# EasyEDA schematic SCH_ProMicro_evo2_v2_2025-11-15.json
TITLE: ProMicro, Temp.sensor; REV: 1.0; Date: 2025-10-28; Sheet: 1/1; Drawn By: corlov; Company: Your Company
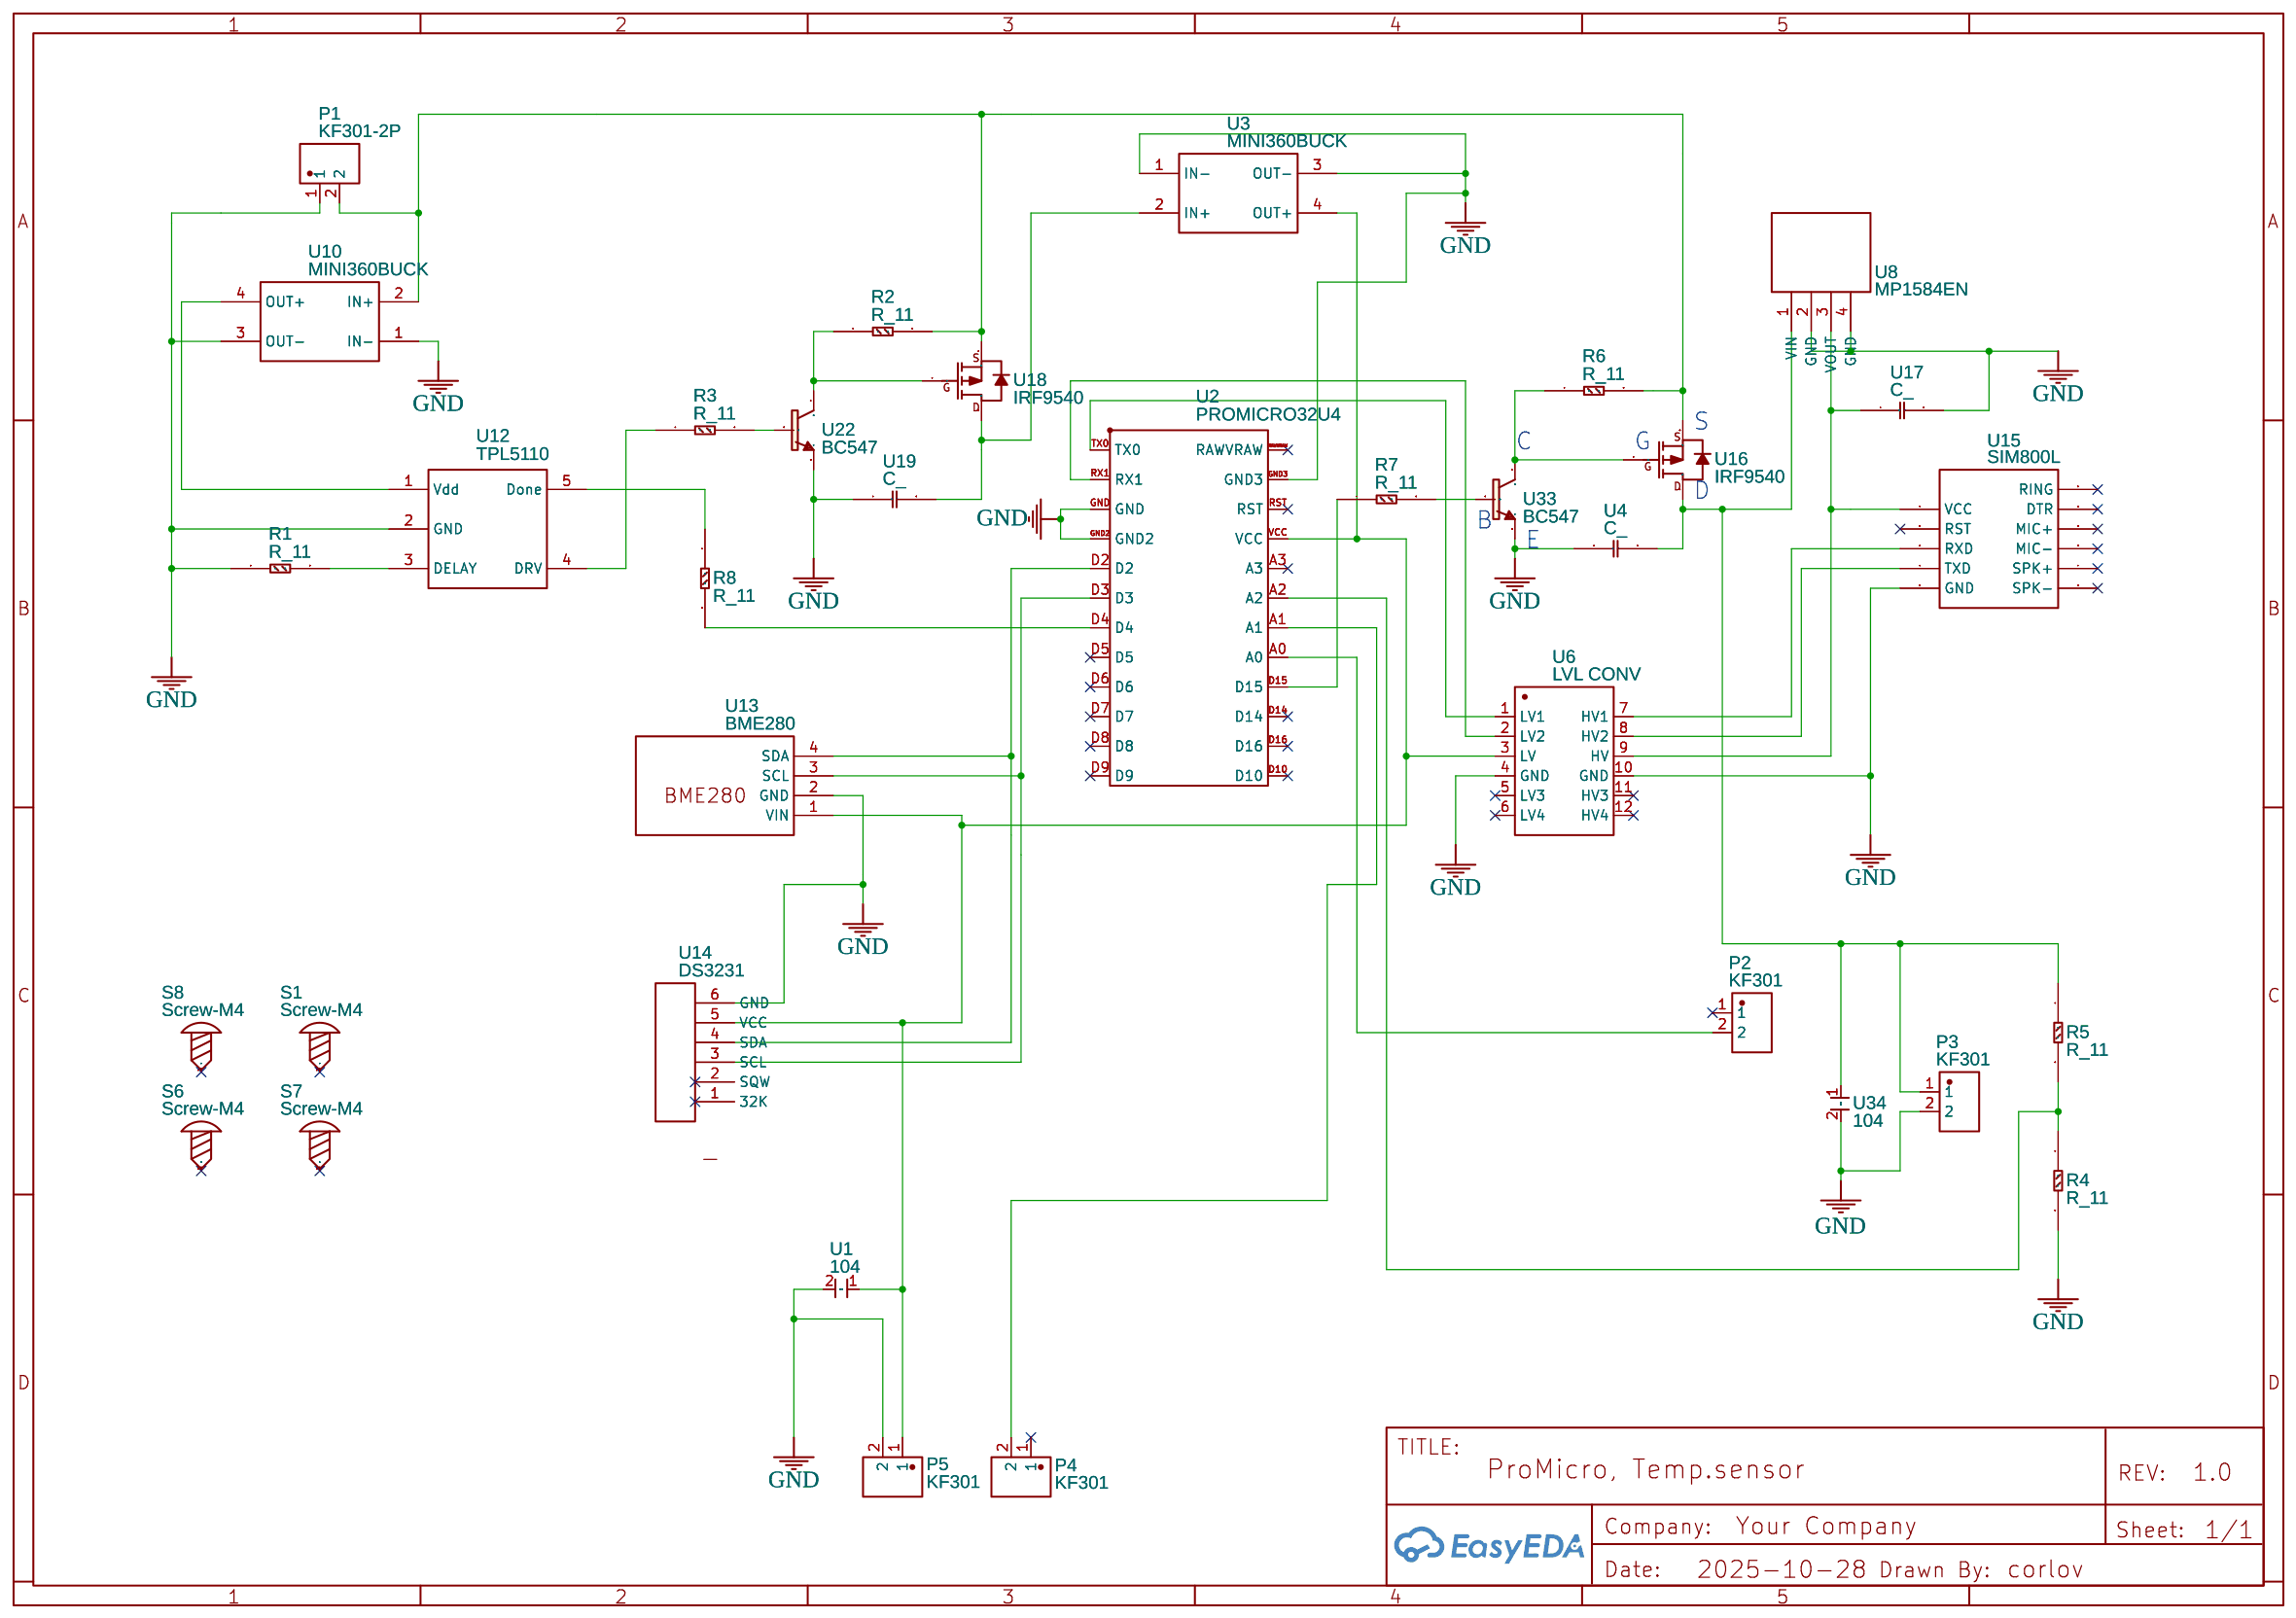
[diagram p0: schematic sheet]

## Parts
P1  KF301-2P  [CONN-TH_XY301V-A-5.0-2P]
P2  KF301  [CONN-TH_XY301V-A-5.0-2P]
P3  KF301  [CONN-TH_XY301V-A-5.0-2P]
P4  KF301  [CONN-TH_XY301V-A-5.0-2P]
P5  KF301  [CONN-TH_XY301V-A-5.0-2P]
R1  R_11  [R_0_125]
R2  R_11  [R_0_125]
R3  R_11  [R_0_125]
R4  R_11  [R_0_125]
R5  R_11  [R_0_125]
R6  R_11  [R_0_125]
R7  R_11  [R_0_125]
R8  R_11  [R_0_125]
S1  Screw-M4  [SCREW-M4]
S6  Screw-M4  [SCREW-M4]
S7  Screw-M4  [SCREW-M4]
S8  Screw-M4  [SCREW-M4]
U1  104  [104]
U2  PROMICRO32U4  [PROMICRO32U4]
U3  MINI360BUCK  [MINI360BUCK]
U4  C_  [C_]
U6  LVL CONV  [LOGICLEVELCONVERTER]
U8  MP1584EN  [MP1584EN]
U10  MINI360BUCK  [MINI360BUCK]
U12  TPL5110  [TPL5110]
U13  BME280  [BME280]
U14  DS3231  [DS3231]
U15  SIM800L  [SIM800L]
U16  IRF9540  [IRF9540]
U17  C_  [C_]
U18  IRF9540  [IRF9540]
U19  C_  [C_]
U22  BC547  [BC547 (2)]
U33  BC547  [BC547 (2)]
U34  104  [104]

## Library data of the parts
P1-P5 = KF301-2P VCC Y GND: Contributor: lcsc; Supplier: LCSC; Supplier Part: C9900016950; Manufacturer: null; Manufacturer Part: KF301-2P接线端子; JLCPCB Part Class: Extended Part
R1-R8 = R_: Contributor: verdenum
S1 S6-S8 = Screw-M4: Contributor: EasyEDA
U1 U34 = 104: Manufacturer: Fe; Contributor: Guest
U2 = PROMICRO32U4: Contributor: alejandro.hdz.eqz
U3 U10 = MINI360BUCK: Contributor: Andrey Fedorov; sourceId: FRLFXR8qI; Manufacturer Part: Mini360; link: http://ali.pub/399f0z
U4 U17 U19 = C_: Contributor: verdenum
U6 = LEVEL CONVERTER 4: Supplier: LCSC; Supplier Part: C2829587; Manufacturer: null; Manufacturer Part: Level Converter 4; Contributor: AtifIqbal; JLCPCB Part Class: Extended Part
U8 = MP1584EN: Contributor: babeinlovexd
U12 = ADAFRUIT TPL5110 BREAKOUT: Manufacturer Part: 3435; Supplier Part: 3435; Supplier: Adafruit; link: https://learn.adafruit.com/adafruit-tpl5110-power-timer-breakout?view=all; Contributor: Sdobout
U13 = BME280: Contributor: allvex
U14 = DS3231 upright: Contributor: poljak1141leonardo
U15 = SIM800L: Contributor: Rafa_2122
U16 U18 = IRF9540: Contributor: alesmo
U22 U33 = BC547: Contributor: joaodahlke

## Nets
GND: P1.1 P3.2 P5.2 R1.1 R4.2 U1.2 U2.GND U2.GND2 U2.GND3 U3.1(IN-) U3.3(OUT-) U4.1 U6.4(GND) U6.10(GND) U8.2(GND) U8.4(GND) U10.1(IN-) U10.3(OUT-) U12.2(GND) U13.2(GND) U14.6(GND) U15.5(GND) U17.2 U19.1 U22.3(E) U33.3(E) U34.2
Net-(P1-2): P1.2 R2.2 R6.2 U10.2(IN+) U16.3(S) U18.3(S)
Net-(P2-2): P2.2 U2.A0
Net-(P3-1): P3.1 R5.1 U4.2 U8.1(VIN) U16.2(D) U34.1
Net-(P4-2): P4.2 U2.A1
Net-(P5-1): P5.1 U1.1 U2.VCC U3.4(OUT+) U6.3(LV) U13.1(VIN) U14.5(VCC)
Net-(R1-2): R1.2 U12.3(DELAY)
Net-(R2-1): R2.1 U18.1(G) U22.1(C)
Net-(R3-1): R3.1 U12.4(DRV)
Net-(R3-2): R3.2 U22.2(B)
Net-(R4-1): R4.1 R5.2 U2.A2
Net-(R6-1): R6.1 U16.1(G) U33.1(C)
Net-(R7-1): R7.1 U2.D15
Net-(R7-2): R7.2 U33.2(B)
Net-(R8-1): R8.1 U12.5(Done)
Net-(R8-2): R8.2 U2.D4
Net-(U2-D2): U2.D2 U13.4(SDA) U14.4(SDA)
Net-(U2-D3): U2.D3 U13.3(SCL) U14.3(SCL)
Net-(U2-RX1): U2.RX1 U6.2(LV2)
Net-(U2-TX0): U2.TX0 U6.1(LV1)
Net-(U3-2): U3.2(IN+) U18.2(D) U19.2
Net-(U6-7): U6.7(HV1) U15.3(RXD)
Net-(U6-8): U6.8(HV2) U15.4(TXD)
Net-(U6-9): U6.9(HV) U8.3(VOUT) U15.1(VCC) U17.1
Net-(U10-4): U10.4(OUT+) U12.1(Vdd)

Not connected (* = marked no-connect by the designer): P2 1*; P4 1*; S1 1*; S6 1*; S7 1*; S8 1*; U2 A3* D5* D6* D7* D8* D9* D10* D14* D16* RAWVRAW* RST*; U6 5(LV3)* 6(LV4)* 11(HV3)* 12(HV4)*; U14 1(32K)* 2(SQW)*; U15 2(RST)* 6(SPK-)* 7(SPK+)* 8(MIC-)* 9(MIC+)* 10(DTR)* 11(RING)*

## Notes on the sheet
- S
- C
- G
- D
- B
- E
